# Altium schematic sheet NSSTC.SchDoc
size A4
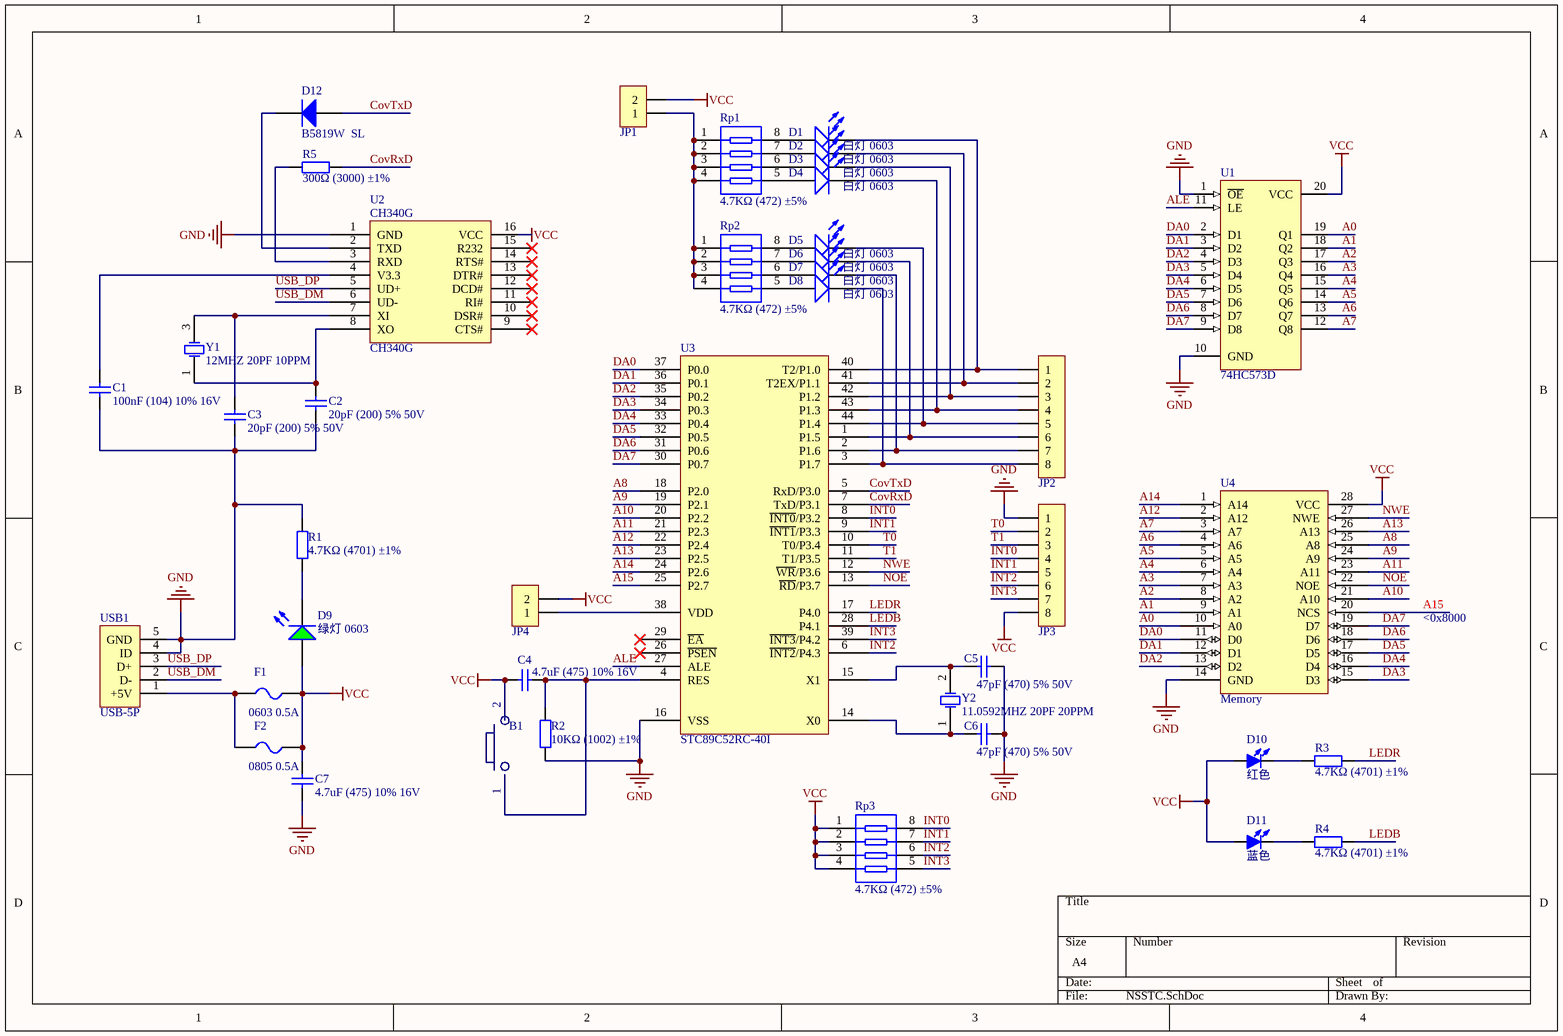
[diagram p0: NSSTC.SchDoc]

## Parts
B1  B?  [MetalButton]  (value not drawn)
C1  100nF (104) 10% 16V  [0402_C]
C2  20pF (200) 5% 50V  [0402_C]
C3  20pF (200) 5% 50V  [0402_C]
C4  4.7uF (475) 10% 16V  [0603_C]
C5  47pF (470) 5% 50V  [0402_C]
C6  47pF (470) 5% 50V  [0402_C]
C7  4.7uF (475) 10% 16V  [0603_C]
D1  白灯 0603  [0603_LED_S1]
D2  白灯 0603  [0603_LED_S1]
D3  白灯 0603  [0603_LED_S1]
D4  白灯 0603  [0603_LED_S1]
D5  白灯 0603  [0603_LED_S1]
D6  白灯 0603  [0603_LED_S1]
D7  白灯 0603  [0603_LED_S1]
D8  白灯 0603  [0603_LED_S1]
D9  绿灯 0603  [0603_LED_S1]
D10  红色  [LED 0805R]
D11  蓝色  [LED 0805B]
D12  B5819W  SL  [SOD-123]
F1  0603 0.5A  [FU 0603]
F2  0805 0.5A  [FU 0805]
JP1  HDR-1X2  [HDR2.54-LI-2P]  (value not drawn)
JP2  HDR-1X8  [HDR2.54-LI-8P]  (value not drawn)
JP3  HDR-1X8  [HDR2.54-LI-8P]  (value not drawn)
JP4  HDR-1X2  [HDR2.54-LI-2P]  (value not drawn)
R1  4.7KΩ (4701) ±1%  [0402_R]
R2  10KΩ (1002) ±1%  [0402_R]
R3  4.7KΩ (4701) ±1%  [0402_R]
R4  4.7KΩ (4701) ±1%  [0402_R]
R5  300Ω (3000) ±1%  [0402_R]
Rp1  4.7KΩ (472) ±5%  [0603_Rx4]
Rp2  4.7KΩ (472) ±5%  [0603_Rx4]
Rp3  4.7KΩ (472) ±5%  [0603_Rx4]
U1  74HC573D  [SOIC-20_300mil]
U2  CH340G  [SOIC-16_150mil]
U3  STC89C52RC-40I  [LQFP-44_10x10x08P]
U4  Memory  [DIP28-600]
USB1  USB-5P  [USB-MICRO_D]
Y1  12MHZ 20PF 10PPM  [SMD-3225_4P]
Y2  11.0592MHZ 20PF 20PPM  [SMD-5032_2P]

## Nets
GND: C1.1 C2.1 C3.1 C5.2 C6.2 C7.1 JP3.1 R1.2 R2.1 U1.1(~{OE}) U1.10(GND) U2.1(GND) U3.16(VSS) U4.14(GND) USB1.4(ID) USB1.5(GND)
VCC: B1.2 C4.2 C7.2 D9.A D10.1(A) D11.1(A) F1.1 F2.2 JP1.2 JP3.8 JP4.2 Rp3.1 Rp3.2 Rp3.3 Rp3.4 U1.20(VCC) U2.16(VCC) U4.28(VCC)
A0: U1.19(Q1) U4.10(A0)
A1: U1.18(Q2) U4.9(A1)
A2: U1.17(Q3) U4.8(A2)
A3: U1.16(Q4) U4.7(A3)
A4: U1.15(Q5) U4.6(A4)
A5: U1.14(Q6) U4.5(A5)
A6: U1.13(Q7) U4.4(A6)
A7: U1.12(Q8) U4.3(A7)
A8: U3.18(P2.0) U4.25(A8)
A9: U3.19(P2.1) U4.24(A9)
A10: U3.20(P2.2) U4.21(A10)
A11: U3.21(P2.3) U4.23(A11)
A12: U3.22(P2.4) U4.2(A12)
A13: U3.23(P2.5) U4.26(A13)
A14: U3.24(P2.6) U4.1(A14)
A15: U3.25(P2.7) U4.20(NCS)
ALE: U1.11(LE) U3.27(ALE)
CovRxD: R5.2 U3.7(TxD/P3.1)
CovTxD: D12.1(A) U3.5(RxD/P3.0)
DA0: U1.2(D1) U3.37(P0.0) U4.11(D0)
DA1: U1.3(D2) U3.36(P0.1) U4.12(D1)
DA2: U1.4(D3) U3.35(P0.2) U4.13(D2)
DA3: U1.5(D4) U3.34(P0.3) U4.15(D3)
DA4: U1.6(D5) U3.33(P0.4) U4.16(D4)
DA5: U1.7(D6) U3.32(P0.5) U4.17(D5)
DA6: U1.8(D7) U3.31(P0.6) U4.18(D6)
DA7: U1.9(D8) U3.30(P0.7) U4.19(D7)
INT0: JP3.4 Rp3.8 U3.8(~{INT0}/P3.2)
INT1: JP3.5 Rp3.7 U3.9(~{INT1}/P3.3)
INT2: JP3.6 Rp3.6 U3.6(~{INT2}/P4.3)
INT3: JP3.7 Rp3.5 U3.39(~{INT3}/P4.2)
LEDB: R4.1 U3.28(P4.1)
LEDR: R3.1 U3.17(P4.0)
NOE: U3.13(~{RD}/P3.7) U4.22(NOE)
NWE: U3.12(~{WR}/P3.6) U4.27(NWE)
T0: JP3.2 U3.10(T0/P3.4)
T1: JP3.3 U3.11(T1/P3.5)
USB_DM: U2.6(UD-) USB1.2(D-)
USB_DP: U2.5(UD+) USB1.3(D+)
NetB1_1: B1.1 C4.1 R2.2 U3.4(RES)
NetC1_2: C1.2 U2.4(V3.3)
NetC2_2: C2.2 U2.8(XO) Y1.1(OSC1)
NetC3_2: C3.2 U2.7(XI) Y1.3(OSC2)
NetC5_1: C5.1 U3.15(X1) Y2.2(OSC2)
NetC6_1: C6.1 U3.14(X0) Y2.1(OSC1)
NetD1_A: D1.A Rp1.8
NetD1_K: D1.K JP2.1 U3.40(T2/P1.0)
NetD2_A: D2.A Rp1.7
NetD2_K: D2.K JP2.2 U3.41(T2EX/P1.1)
NetD3_A: D3.A Rp1.6
NetD3_K: D3.K JP2.3 U3.42(P1.2)
NetD4_A: D4.A Rp1.5
NetD4_K: D4.K JP2.4 U3.43(P1.3)
NetD5_A: D5.A Rp2.8
NetD5_K: D5.K JP2.5 U3.44(P1.4)
NetD6_A: D6.A Rp2.7
NetD6_K: D6.K JP2.6 U3.1(P1.5)
NetD7_A: D7.A Rp2.6
NetD7_K: D7.K JP2.7 U3.2(P1.6)
NetD8_A: D8.A Rp2.5
NetD8_K: D8.K JP2.8 U3.3(P1.7)
NetD9_K: D9.K R1.1
NetD10_2: D10.2(K) R3.2
NetD11_2: D11.2(K) R4.2
NetD12_2: D12.2(K) U2.2(TXD)
NetF1_2: F1.2 F2.1 USB1.1(+5V)
NetJP1_1: JP1.1 Rp1.1 Rp1.2 Rp1.3 Rp1.4 Rp2.1 Rp2.2 Rp2.3 Rp2.4
NetJP4_1: JP4.1 U3.38(VDD)
NetR5_1: R5.1 U2.3(RXD)

Not connected (* = marked no-connect by the designer): U2 9(CTS#)* 10(DSR#)* 11(RI#)* 12(DCD#)* 13(DTR#)* 14(RTS#)* 15(R232)*; U3 26(~{PSEN})* 29(~{EA})*

## Notes on the sheet
- <0x8000

## Library data of the parts
B1 = MetalButton
C1 = 0402 100nF (104) 10% 16V: 贴片电容; ComponentLink1Description: 供应商链接; ComponentLink1URL: http://www.szlcsc.com/product/details_1877.html; Package: 0402; Supplier: LC; SuppliersPartNumber: C1525
C2 C3 = 0402 20pF (200) 5% 50V: 贴片电容; ComponentLink1Description: 供应商链接; ComponentLink1URL: http://www.szlcsc.com/product/details_1906.html; Package: 0402; Supplier: LC; SuppliersPartNumber: C1554
C4 C7 = 0603 4.7uF (475) 10% 16V: 贴片电容; ComponentLink1Description: 供应商链接; ComponentLink1URL: http://www.szlcsc.com/product/details_20375.html; Package: 0603; Supplier: LC; SuppliersPartNumber: C19666
C5 C6 = 0402 47pF (470) 5% 50V: 贴片电容; ComponentLink1Description: 供应商链接; ComponentLink1URL: http://www.szlcsc.com/product/details_1919.html; Package: 0402; Supplier: LC; SuppliersPartNumber: C1567
D1-D8 = 0603 白灯: 发光二极管; ComponentLink1Description: 供应商链接; ComponentLink1URL: http://www.szlcsc.com/product/details_2663.html; Package: 0603; Supplier: LC; SuppliersPartNumber: C2290
D9 = 0603 绿灯: 发光二极管; ComponentLink1Description: 供应商链接; ComponentLink1URL: http://www.szlcsc.com/product/details_73152.html; Package: 0603; Supplier: LC; SuppliersPartNumber: C72043
D10 D11 = LED-SMD: 贴片LED; 版权归属: 源创客; BOM名称: 贴片LED; 学习资源: www.ooocke.com
D12 = SOD-123 B5819W  SL: 肖特基二极管; ComponentLink1Description: 供应商链接; ComponentLink1URL: http://www.szlcsc.com/product/details_9093.html; Package: SOD-123; Supplier: LC; SuppliersPartNumber: C8598
F1 F2 = FU: 贴片保险丝; 版权归属: 源创客; BOM名称: 贴片保险丝; 学习资源: www.ooocke.com
JP1 JP4 = Header 2: 2P接插件; 版权归属: 源创客; BOM名称: 2P接插件; 学习资源: www.ooocke.com
JP2 JP3 = Header 8: 8P接插件; 版权归属: 源创客; BOM名称: 8P接插件; 学习资源: www.ooocke.com
R1 R3 R4 = 0402 4.7KΩ (4701) 1%: 贴片电阻; ComponentLink1Description: 供应商链接; ComponentLink1URL: http://www.szlcsc.com/product/details_26643.html; Package: 0402; Supplier: LC; SuppliersPartNumber: C25900
R2 = 0402 10KΩ (1002) 1%: 贴片电阻; ComponentLink1Description: 供应商链接; ComponentLink1URL: http://www.szlcsc.com/product/details_26487.html; Package: 0402; Supplier: LC; SuppliersPartNumber: C25744
R5 = 0402 300Ω (3000) 1%: 贴片电阻; ComponentLink1Description: 供应商链接; ComponentLink1URL: http://www.szlcsc.com/product/details_25845.html; Package: 0402; Supplier: LC; SuppliersPartNumber: C25102
Rp1-Rp3 = 0603*4  4.7KΩ (472) 5%: 贴片排阻; ComponentLink1Description: 供应商链接; ComponentLink1URL: http://www.szlcsc.com/product/details_2332.html; Package: 0603*4; Supplier: LC; SuppliersPartNumber: C1980
U1 = 74HC573D_[C5608]: 74系列逻辑芯片; ComponentLink1Description: 供应商链接; ComponentLink1URL: http://www.szlcsc.com/product/details_6059.html; Package: SOIC-20_300mil; Supplier: LC; SuppliersPartNumber: C5608
U2 = CH340G_[C14267]: USB; ComponentLink1Description: 供应商链接; ComponentLink1URL: http://www.szlcsc.com/product/details_14927.html; Package: SOIC-16_150mil; Supplier: LC; SuppliersPartNumber: C14267
U3 = STC89C52RC-40I: MCU; ComponentLink1Description: 供应商链接; ComponentLink1URL: http://www.szlcsc.com/product/details_9213.html; Package: LQFP-44_10x10x08P; Supplier: LC; SuppliersPartNumber: C8707
USB1 = USB-5P: 微型USB母座; 版权归属: 源创客; BOM名称: 微型USB母座; 学习资源: www.ooocke.com
Y1 = SMD-3225_4P  12MHZ 20PF 10PPM: 贴片晶振; ComponentLink1Description: 供应商链接; ComponentLink1URL: http://www.szlcsc.com/product/details_9522.html; Package: SMD-3225_4P; Supplier: LC; SuppliersPartNumber: C9002
Y2 = SMD-5032_2P 11.0592MHZ 20PF 20PPM: 贴片晶振; ComponentLink1Description: 供应商链接; ComponentLink1URL: http://www.szlcsc.com/product/details_53039.html; Package: SMD-5032_2P; Supplier: LC; SuppliersPartNumber: C52026